# Altium schematic sheet RTM_CON.SchDoc
size A3; DocumentNumber: 21; SheetNumber: 21; SheetTotal: 30
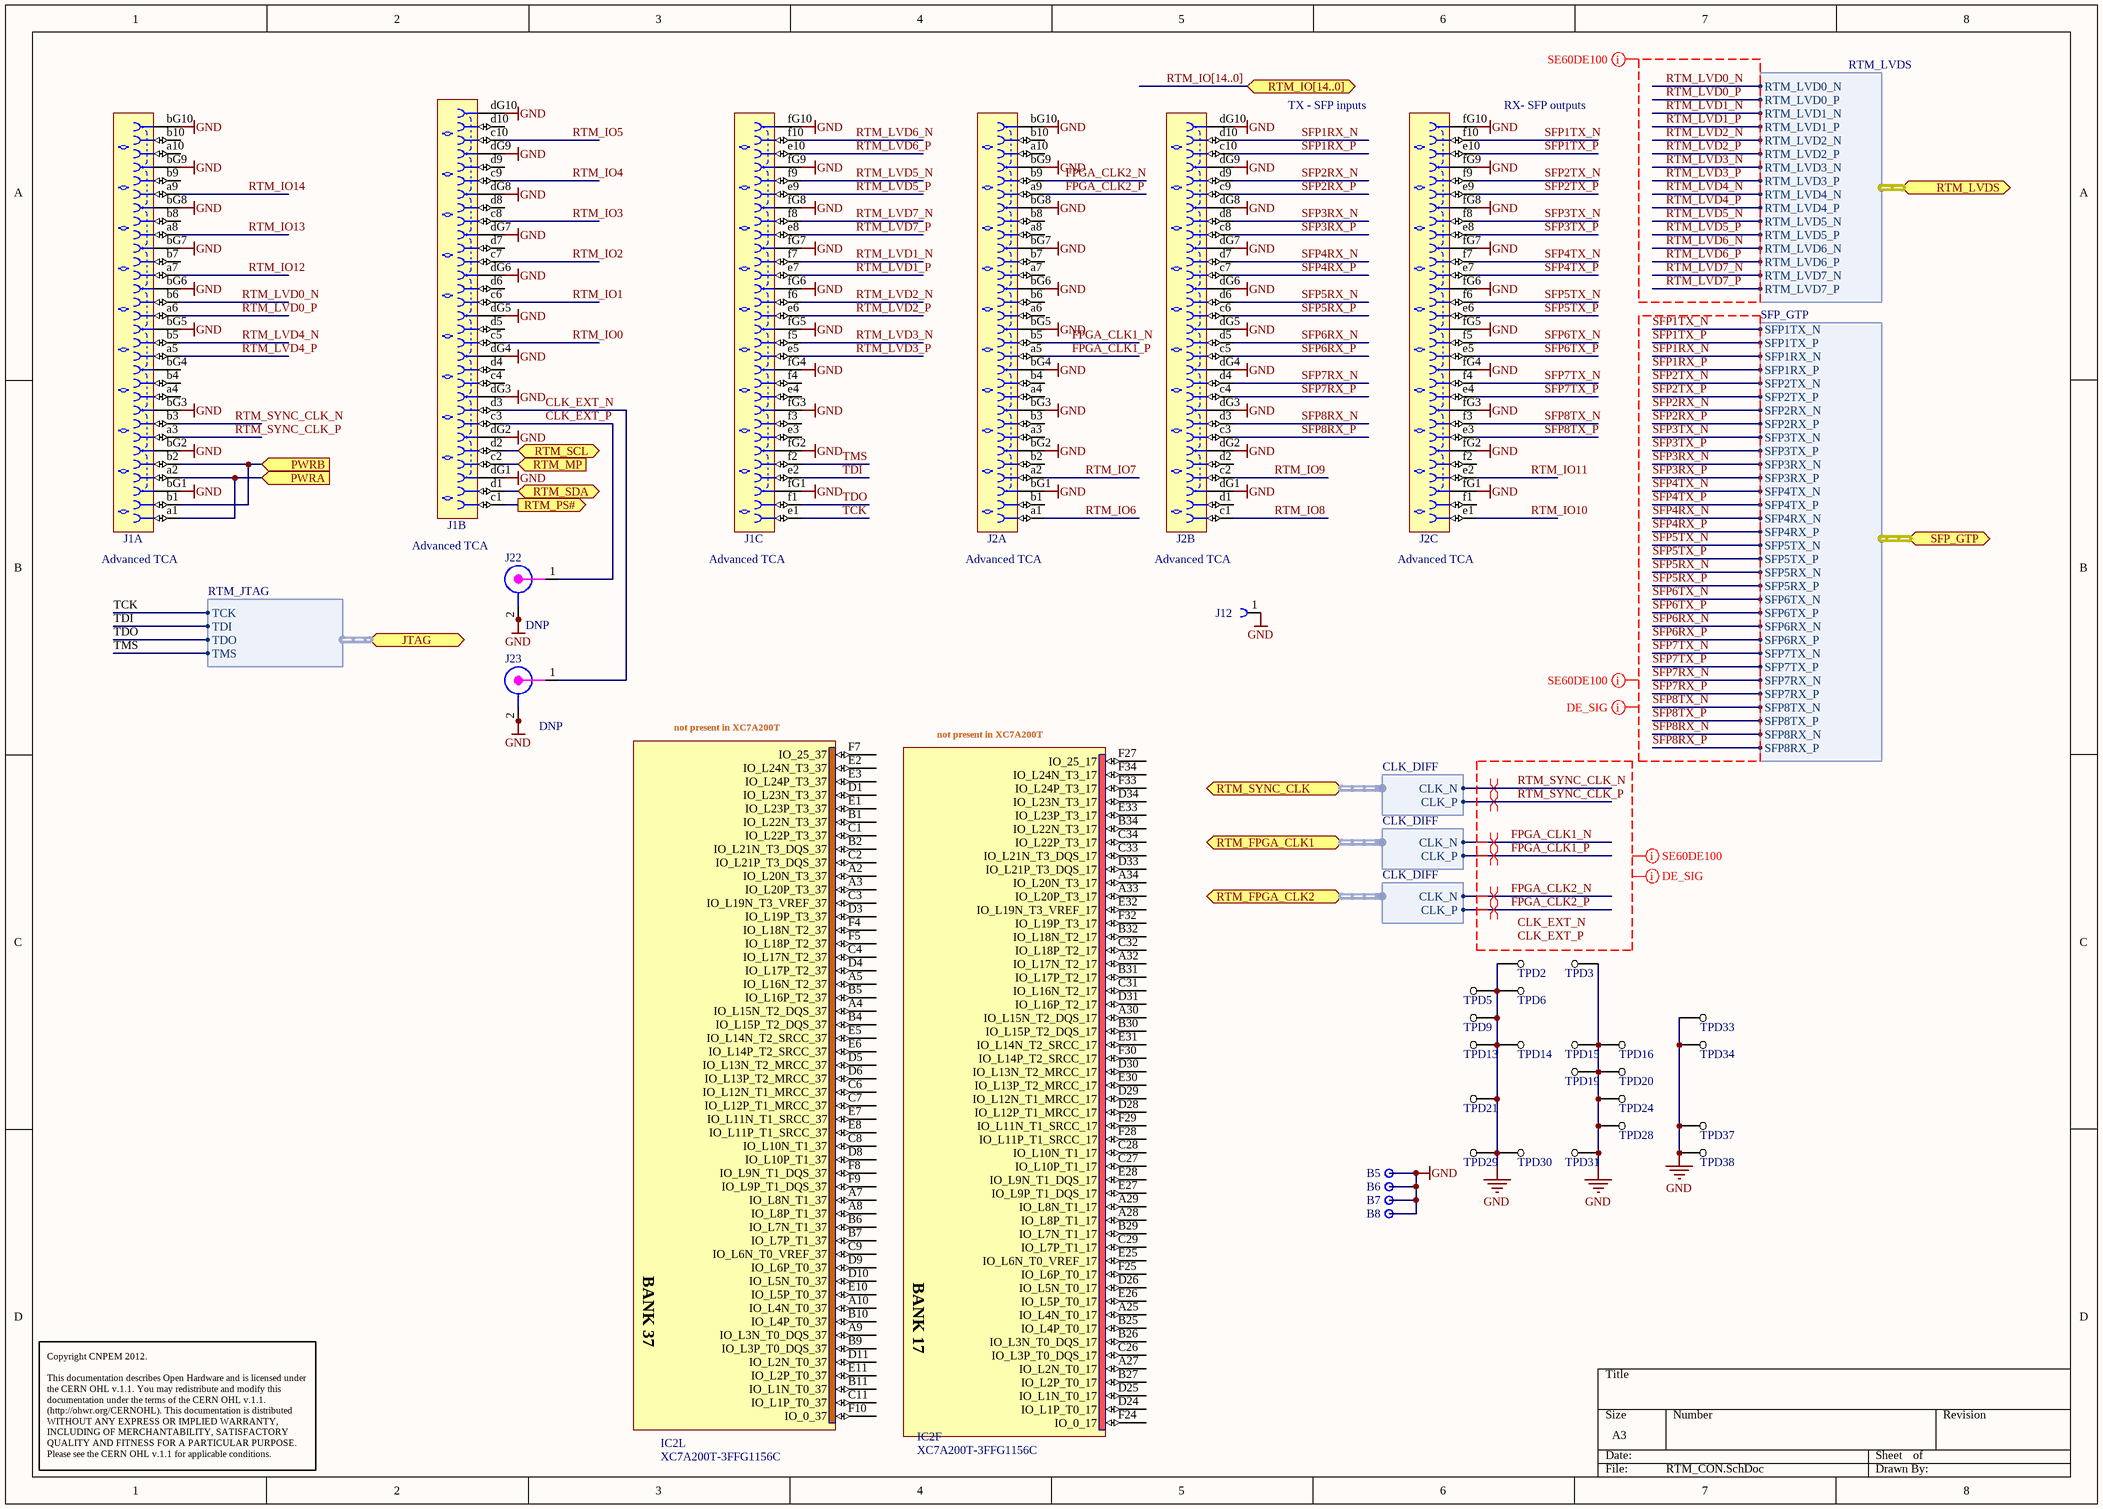
[diagram p0: RTM_CON.SchDoc]

## Parts
B5  Test Point  [VERO_20-2136]  (value not drawn)
B6  Test Point  [VERO_20-2136]  (value not drawn)
B7  Test Point  [VERO_20-2136]  (value not drawn)
B8  Test Point  [VERO_20-2136]  (value not drawn)
IC2  XC7A200T-3FFG1156C  [BGA1156C100P34X34_3500X3500X335]  (parts F,L of 23)
J1  Advanced TCA  [TYCO_6469081-1]  (parts A,B,C of 3)
J2  Advanced TCA  [TYCO_6469081-1]  (parts A,B,C of 3)
J12  (no value)  [TYCO_5120913-1]
J22  DNP  [CON_UFL_HIROSE_RECEPTACLE]
J23  DNP  [CON_UFL_HIROSE_RECEPTACLE]
TPD2  Test Point  [TP_DIFF_0805]  (value not drawn)
TPD3  Test Point  [TP_DIFF_0805]  (value not drawn)
TPD5  Test Point  [TP_DIFF_0805]  (value not drawn)
TPD6  Test Point  [TP_DIFF_0805]  (value not drawn)
TPD9  Test Point  [TP_DIFF_0805]  (value not drawn)
TPD13  Test Point  [TP_DIFF_0805]  (value not drawn)
TPD14  Test Point  [TP_DIFF_0805]  (value not drawn)
TPD15  Test Point  [TP_DIFF_0805]  (value not drawn)
TPD16  Test Point  [TP_DIFF_0805]  (value not drawn)
TPD19  Test Point  [TP_DIFF_0805]  (value not drawn)
TPD20  Test Point  [TP_DIFF_0805]  (value not drawn)
TPD21  Test Point  [TP_DIFF_0805]  (value not drawn)
TPD24  Test Point  [TP_DIFF_0805]  (value not drawn)
TPD28  Test Point  [TP_DIFF_0805]  (value not drawn)
TPD29  Test Point  [TP_DIFF_0805]  (value not drawn)
TPD30  Test Point  [TP_DIFF_0805]  (value not drawn)
TPD31  Test Point  [TP_DIFF_0805]  (value not drawn)
TPD33  Test Point  [TP_DIFF_0805]  (value not drawn)
TPD34  Test Point  [TP_DIFF_0805]  (value not drawn)
TPD37  Test Point  [TP_DIFF_0805]  (value not drawn)
TPD38  Test Point  [TP_DIFF_0805]  (value not drawn)

## Ports
JTAG (harness RTM_JTAG), PWRA (in), PWRB (in), RTM_FPGA_CLK1 (harness CLK_DIFF), RTM_FPGA_CLK2 (harness CLK_DIFF), RTM_IO[14..0] (bidir, harness JTAG), RTM_LVDS (harness RTM_LVDS), RTM_MP (in), RTM_PS# (out), RTM_SCL (bidir), RTM_SDA (bidir), RTM_SYNC_CLK (harness CLK_DIFF), SFP_GTP (harness SFP_GTP)

## Harnesses
RTM_LVDS: RTM_LVD0_N, RTM_LVD0_P, RTM_LVD1_N, RTM_LVD1_P, RTM_LVD2_N, RTM_LVD2_P, RTM_LVD3_N, RTM_LVD3_P, RTM_LVD4_N, RTM_LVD4_P, RTM_LVD5_N, RTM_LVD5_P, RTM_LVD6_N, RTM_LVD6_P, RTM_LVD7_N, RTM_LVD7_P
SFP_GTP: SFP1RX_N, SFP1RX_P, SFP1TX_N, SFP1TX_P, SFP2TX_N, SFP2TX_P, SFP2RX_N, SFP2RX_P, SFP3TX_N, SFP3TX_P, SFP3RX_N, SFP3RX_P, SFP4TX_N, SFP4TX_P, SFP4RX_N, SFP4RX_P, SFP5TX_N, SFP5TX_P, SFP5RX_N, SFP5RX_P, SFP6TX_N, SFP6TX_P, SFP6RX_N, SFP6RX_P, SFP7TX_N, SFP7TX_P, SFP7RX_N, SFP7RX_P, SFP8TX_N, SFP8TX_P, SFP8RX_N, SFP8RX_P
RTM_JTAG: TCK, TDI, TDO, TMS
CLK_DIFF: CLK_P, CLK_N

## Nets
GND: B5.1 B6.1 B7.1 B8.1 J1.bG1 J1.bG2 J1.bG3 J1.bG5 J1.bG6 J1.bG7 J1.bG8 J1.bG9 J1.bG10 J1.dG1 J1.dG2 J1.dG3 J1.dG4 J1.dG5 J1.dG6 J1.dG7 J1.dG8 J1.dG9 J1.dG10 J1.fG1 J1.fG2 J1.fG3 J1.fG4 J1.fG5 J1.fG6 J1.fG7 J1.fG8 J1.fG9 J1.fG10 J2.bG1 J2.bG2 J2.bG3 J2.bG4 J2.bG5 J2.bG6 J2.bG7 J2.bG8 J2.bG9 J2.bG10 J2.dG1 J2.dG2 J2.dG3 J2.dG4 J2.dG5 J2.dG6 J2.dG7 J2.dG8 J2.dG9 J2.dG10 J2.fG1 J2.fG2 J2.fG3 J2.fG4 J2.fG5 J2.fG6 J2.fG7 J2.fG8 J2.fG9 J2.fG10 J12.1 J22.2 J22.2a(GND) J23.2 J23.2a(GND) TPD2.1(TP) TPD3.1(TP) TPD5.1(TP) TPD6.1(TP) TPD9.1(TP) TPD13.1(TP) TPD14.1(TP) TPD15.1(TP) TPD16.1(TP) TPD19.1(TP) TPD20.1(TP) TPD21.1(TP) TPD24.1(TP) TPD28.1(TP) TPD29.1(TP) TPD30.1(TP) TPD31.1(TP) TPD33.1(TP) TPD34.1(TP) TPD37.1(TP) TPD38.1(TP)
CLK_EXT_N: J1.d3 J23.1
CLK_EXT_P: J1.c3 J22.1
FPGA_CLK1_N: J2.b5 ; port RTM_FPGA_CLK1.CLK_N
FPGA_CLK1_P: J2.a5 ; port RTM_FPGA_CLK1.CLK_P
FPGA_CLK2_N: J2.b9 ; port RTM_FPGA_CLK2.CLK_N
FPGA_CLK2_P: J2.a9 ; port RTM_FPGA_CLK2.CLK_P
PWRA: J1.a1 J1.a2 ; port PWRA
PWRB: J1.b1 J1.b2 ; port PWRB
RTM_IO0: J1.c5
RTM_IO1: J1.c6
RTM_IO2: J1.c7
RTM_IO3: J1.c8
RTM_IO4: J1.c9
RTM_IO5: J1.c10
RTM_IO6: J2.a1
RTM_IO7: J2.a2
RTM_IO8: J2.c1
RTM_IO9: J2.c2
RTM_IO10: J2.e1
RTM_IO11: J2.e2
RTM_IO12: J1.a7
RTM_IO13: J1.a8
RTM_IO14: J1.a9
RTM_LVD0_N: J1.b6 ; port RTM_LVDS.RTM_LVD0_N
RTM_LVD0_P: J1.a6 ; port RTM_LVDS.RTM_LVD0_P
RTM_LVD1_N: J1.f7 ; port RTM_LVDS.RTM_LVD1_N
RTM_LVD1_P: J1.e7 ; port RTM_LVDS.RTM_LVD1_P
RTM_LVD2_N: J1.f6 ; port RTM_LVDS.RTM_LVD2_N
RTM_LVD2_P: J1.e6 ; port RTM_LVDS.RTM_LVD2_P
RTM_LVD3_N: J1.f5 ; port RTM_LVDS.RTM_LVD3_N
RTM_LVD3_P: J1.e5 ; port RTM_LVDS.RTM_LVD3_P
RTM_LVD4_N: J1.b5 ; port RTM_LVDS.RTM_LVD4_N
RTM_LVD4_P: J1.a5 ; port RTM_LVDS.RTM_LVD4_P
RTM_LVD5_N: J1.f9 ; port RTM_LVDS.RTM_LVD5_N
RTM_LVD5_P: J1.e9 ; port RTM_LVDS.RTM_LVD5_P
RTM_LVD6_N: J1.f10 ; port RTM_LVDS.RTM_LVD6_N
RTM_LVD6_P: J1.e10 ; port RTM_LVDS.RTM_LVD6_P
RTM_LVD7_N: J1.f8 ; port RTM_LVDS.RTM_LVD7_N
RTM_LVD7_P: J1.e8 ; port RTM_LVDS.RTM_LVD7_P
RTM_MP: J1.c2 ; port RTM_MP
RTM_PS#: J1.c1 ; port RTM_PS#
RTM_SCL: J1.d2 ; port RTM_SCL
RTM_SDA: J1.d1 ; port RTM_SDA
RTM_SYNC_CLK_N: J1.b3 ; port RTM_SYNC_CLK.CLK_N
RTM_SYNC_CLK_P: J1.a3 ; port RTM_SYNC_CLK.CLK_P
SFP1RX_N: J2.d10 ; port SFP_GTP.SFP1RX_N
SFP1RX_P: J2.c10 ; port SFP_GTP.SFP1RX_P
SFP1TX_N: J2.f10 ; port SFP_GTP.SFP1TX_N
SFP1TX_P: J2.e10 ; port SFP_GTP.SFP1TX_P
SFP2RX_N: J2.d9 ; port SFP_GTP.SFP2RX_N
SFP2RX_P: J2.c9 ; port SFP_GTP.SFP2RX_P
SFP2TX_N: J2.f9 ; port SFP_GTP.SFP2TX_N
SFP2TX_P: J2.e9 ; port SFP_GTP.SFP2TX_P
SFP3RX_N: J2.d8 ; port SFP_GTP.SFP3RX_N
SFP3RX_P: J2.c8 ; port SFP_GTP.SFP3RX_P
SFP3TX_N: J2.f8 ; port SFP_GTP.SFP3TX_N
SFP3TX_P: J2.e8 ; port SFP_GTP.SFP3TX_P
SFP4RX_N: J2.d7 ; port SFP_GTP.SFP4RX_N
SFP4RX_P: J2.c7 ; port SFP_GTP.SFP4RX_P
SFP4TX_N: J2.f7 ; port SFP_GTP.SFP4TX_N
SFP4TX_P: J2.e7 ; port SFP_GTP.SFP4TX_P
SFP5RX_N: J2.d6 ; port SFP_GTP.SFP5RX_N
SFP5RX_P: J2.c6 ; port SFP_GTP.SFP5RX_P
SFP5TX_N: J2.f6 ; port SFP_GTP.SFP5TX_N
SFP5TX_P: J2.e6 ; port SFP_GTP.SFP5TX_P
SFP6RX_N: J2.d5 ; port SFP_GTP.SFP6RX_N
SFP6RX_P: J2.c5 ; port SFP_GTP.SFP6RX_P
SFP6TX_N: J2.f5 ; port SFP_GTP.SFP6TX_N
SFP6TX_P: J2.e5 ; port SFP_GTP.SFP6TX_P
SFP7RX_N: J2.d4 ; port SFP_GTP.SFP7RX_N
SFP7RX_P: J2.c4 ; port SFP_GTP.SFP7RX_P
SFP7TX_N: J2.f4 ; port SFP_GTP.SFP7TX_N
SFP7TX_P: J2.e4 ; port SFP_GTP.SFP7TX_P
SFP8RX_N: J2.d3 ; port SFP_GTP.SFP8RX_N
SFP8RX_P: J2.c3 ; port SFP_GTP.SFP8RX_P
SFP8TX_N: J2.f3 ; port SFP_GTP.SFP8TX_N
SFP8TX_P: J2.e3 ; port SFP_GTP.SFP8TX_P
TCK: J1.e1 ; port JTAG.TCK
TDI: J1.e2 ; port JTAG.TDI
TDO: J1.f1 ; port JTAG.TDO
TMS: J1.f2 ; port JTAG.TMS

Not connected (* = marked no-connect by the designer): IC2 A2(IO_L20N_T3_37) A3(IO_L20P_T3_37) A4(IO_L15N_T2_DQS_37) A5(IO_L16N_T2_37) A7(IO_L8N_T1_37) A8(IO_L8P_T1_37) A9(IO_L3N_T0_DQS_37) A10(IO_L4N_T0_37) A25(IO_L4N_T0_17) A27(IO_L2N_T0_17) A28(IO_L8P_T1_17) A29(IO_L8N_T1_17) A30(IO_L15N_T2_DQS_17) A32(IO_L17N_T2_17) A33(IO_L20P_T3_17) A34(IO_L20N_T3_17) B1(IO_L22N_T3_37) B2(IO_L21N_T3_DQS_37) B4(IO_L15P_T2_DQS_37) B5(IO_L16P_T2_37) B6(IO_L7N_T1_37) B7(IO_L7P_T1_37) B9(IO_L3P_T0_DQS_37) B10(IO_L4P_T0_37) B11(IO_L1N_T0_37) B25(IO_L4P_T0_17) B26(IO_L3N_T0_DQS_17) B27(IO_L2P_T0_17) B29(IO_L7N_T1_17) B30(IO_L15P_T2_DQS_17) B31(IO_L17P_T2_17) B32(IO_L18N_T2_17) B34(IO_L22N_T3_17) C1(IO_L22P_T3_37) C2(IO_L21P_T3_DQS_37) C3(IO_L19N_T3_VREF_37) C4(IO_L17N_T2_37) C6(IO_L12N_T1_MRCC_37) C7(IO_L12P_T1_MRCC_37) C8(IO_L10N_T1_37) C9(IO_L6N_T0_VREF_37) C11(IO_L1P_T0_37) C26(IO_L3P_T0_DQS_17) C27(IO_L10P_T1_17) C28(IO_L10N_T1_17) C29(IO_L7P_T1_17) C31(IO_L16N_T2_17) C32(IO_L18P_T2_17) C33(IO_L21N_T3_DQS_17) C34(IO_L22P_T3_17) D1(IO_L23N_T3_37) D3(IO_L19P_T3_37) D4(IO_L17P_T2_37) D5(IO_L13N_T2_MRCC_37) D6(IO_L13P_T2_MRCC_37) D8(IO_L10P_T1_37) D9(IO_L6P_T0_37) D10(IO_L5N_T0_37) D11(IO_L2N_T0_37) D24(IO_L1P_T0_17) D25(IO_L1N_T0_17) D26(IO_L5N_T0_17) D28(IO_L12P_T1_MRCC_17) D29(IO_L12N_T1_MRCC_17) D30(IO_L13N_T2_MRCC_17) D31(IO_L16P_T2_17) D33(IO_L21P_T3_DQS_17) D34(IO_L23N_T3_17) E1(IO_L23P_T3_37) E2(IO_L24N_T3_37) E3(IO_L24P_T3_37) E5(IO_L14N_T2_SRCC_37) E6(IO_L14P_T2_SRCC_37) E7(IO_L11N_T1_SRCC_37) E8(IO_L11P_T1_SRCC_37) E10(IO_L5P_T0_37) E11(IO_L2P_T0_37) E25(IO_L6N_T0_VREF_17) E26(IO_L5P_T0_17) E27(IO_L9P_T1_DQS_17) E28(IO_L9N_T1_DQS_17) E30(IO_L13P_T2_MRCC_17) E31(IO_L14N_T2_SRCC_17) E32(IO_L19N_T3_VREF_17) E33(IO_L23P_T3_17) F4(IO_L18N_T2_37) F5(IO_L18P_T2_37) F7(IO_25_37) F8(IO_L9N_T1_DQS_37) F9(IO_L9P_T1_DQS_37) F10(IO_0_37) F24(IO_0_17) F25(IO_L6P_T0_17) F27(IO_25_17) F28(IO_L11P_T1_SRCC_17) F29(IO_L11N_T1_SRCC_17) F30(IO_L14P_T2_SRCC_17) F32(IO_L19P_T3_17) F33(IO_L24P_T3_17) F34(IO_L24N_T3_17); J1 a4 a10 b4 b7 b8 b9 b10 bG4 c4 d4 d5 d6 d7 d8 d9 d10 e3 e4 f3 f4; J2 a3 a4 a6 a7 a8 a10 b1 b2 b3 b4 b6 b7 b8 b10 d1 d2 f1 f2

## Buses and harness runs
bus RTM_IO[14..0]

## Layout directives
net class SE60DE100: CLK_EXT_N, CLK_EXT_P, FPGA_CLK1_N, FPGA_CLK1_P, FPGA_CLK2_N, FPGA_CLK2_P, RTM_LVD0_N, RTM_LVD0_P, RTM_LVD1_N, RTM_LVD1_P, RTM_LVD2_N, RTM_LVD2_P, RTM_LVD3_N, RTM_LVD3_P, RTM_LVD4_N, RTM_LVD4_P, RTM_LVD5_N, RTM_LVD5_P, RTM_LVD6_N, RTM_LVD6_P, RTM_LVD7_N, RTM_LVD7_P, RTM_SYNC_CLK_N, RTM_SYNC_CLK_P, SFP1RX_N, SFP1RX_P, SFP1TX_N, SFP1TX_P, SFP2RX_N, SFP2RX_P, SFP2TX_N, SFP2TX_P, SFP3RX_N, SFP3RX_P, SFP3TX_N, SFP3TX_P, SFP4RX_N, SFP4RX_P, SFP4TX_N, SFP4TX_P, SFP5RX_N, SFP5RX_P, SFP5TX_N, SFP5TX_P, SFP6RX_N, SFP6RX_P, SFP6TX_N, SFP6TX_P, SFP7RX_N, SFP7RX_P, SFP7TX_N, SFP7TX_P, SFP8RX_N, SFP8RX_P, SFP8TX_N, SFP8TX_P
net class DE_SIG: CLK_EXT_N, CLK_EXT_P, FPGA_CLK1_N, FPGA_CLK1_P, FPGA_CLK2_N, FPGA_CLK2_P, RTM_SYNC_CLK_N, RTM_SYNC_CLK_P, SFP1RX_N, SFP1RX_P, SFP1TX_N, SFP1TX_P, SFP2RX_N, SFP2RX_P, SFP2TX_N, SFP2TX_P, SFP3RX_N, SFP3RX_P, SFP3TX_N, SFP3TX_P, SFP4RX_N, SFP4RX_P, SFP4TX_N, SFP4TX_P, SFP5RX_N, SFP5RX_P, SFP5TX_N, SFP5TX_P, SFP6RX_N, SFP6RX_P, SFP6TX_N, SFP6TX_P, SFP7RX_N, SFP7RX_P, SFP7TX_N, SFP7TX_P, SFP8RX_N, SFP8RX_P, SFP8TX_N, SFP8TX_P
differential pair: FPGA_CLK1_N, FPGA_CLK1_P, FPGA_CLK2_N, FPGA_CLK2_P, RTM_SYNC_CLK_N, RTM_SYNC_CLK_P

## Notes on the sheet
- TX - SFP inputs
- RX- SFP outputs
- not present in XC7A200T
- Copyright CNPEM 2012.
  This documentation describes Open Hardware and is licensed under the CERN OHL v.1.1. You may redistribute and modify this documentation under the terms of the CERN OHL v.1.1. (http://ohwr.org/CERNOHL). This documentation is distributed WITHOUT ANY EXPRESS OR IMPLIED WARRANTY, INCLUDING OF MERCHANTABILITY, SATISFACTORY QUALITY AND FITNESS FOR A PARTICULAR PURPOSE. Please see the CERN OHL v.1.1 for applicable conditions.
- Labels drawn without touching a wire or pin: CLK_EXT_N, CLK_EXT_P
- (in symbol XC7A200T-3FFG1156C, part F) BANK 17
- (in symbol XC7A200T-3FFG1156C, part L) BANK 37

## Library data of the parts
B5-B8 = VERO_20-2136: Single Terminal Socket; Part Description: Black Bead PCB Terminal Test Pin (1.32 mm hole); Manufacturer: VERO TECHNOLOGIES; Table: Miscellaneous; Part Number: VERO_20-2136; Component Kind: Standard; Component Type: Standard; Pin Count: 1; Family: Test Point; Mounted: Yes; Socket: No; SMD: No; Status: None; Manufacturer Part Number: 20-2136; ComponentHeight: 5.3mm; HelpURL: \\cern.ch\dfs\Applications\Altium\Datasheets\VERO_20-2136.pdf; Author: CERN DEM JLC; CreateDate: 21/07/2008; LatestRevisionDate: 21/07/2008
IC2 = XC7A200T-3FFG1156C: Artix-6 FPGA, 16 GTPs, 600 User I/Os, 1156-Pin BGA, Speed Grade 2, Commercial Grade, Pb-Free; Part Description: Artix-7 FPGA, 16 GTPs, 600 User I/Os, 1156-Pin BGA, Speed Grade 2, Commercial Grade, Pb-Free; Manufacturer: XILINX; Table: Logic; Part Number: XC7A200T-3FFG1156C; Component Kind: Standard; Component Type: Standard; Device: XC7A200T-3FFG1156C; PackageDescription: BGA, 1.00mm Pitch, Square; 1156 Pin, 34 Columns X 34 Rows, 35.00mm X 35.00mm X 3.350mm H; Manufacturer Part Number: XC7A200T-3FFG1156C; Pin Count: 1156; Case: BGA1156; Mounted: Yes; Socket: No; SMD: Yes; ComponentHeight: 3.35mm; HelpURL: \\cern.ch\dfs\Applications\Altium\Datasheets\XC7A350T-2FFG1156C.pdf; ComponentLink1URL: \\cern.ch\dfs\Applications\Altium\Datasheets\XC7A350T-2FFG1156C.pdf; ComponentLink1Description: Package/Pinout; Author: CERN DEM JLC; CreateDate: 2012-09-19; LatestRevisionDate: 2012-09-19
J1 J2 = TYCO_6469081-1: Connector 60 ATCA Female 30 Pairs (60 Signals) + 3x10 Ground; Part Description: 60 Positions, Pitch 2.5mm,  Advanced TCA, Z-PACK HM-Zd Right Angle Press Fit Receptacle; Manufacturer: TYCO ELECTRONICS; Table: TYCO; Part Number: TYCO_6469081-1; Component Kind: Standard; Component Type: Standard; Pin Count: 90; Family: Advanced TCA; Mounted: Yes; Socket: No; SMD: No; Status: None; Manufacturer Part Number: 6469081-1; ComponentHeight: 12.18mm; HelpURL: \\cern.ch\dfs\Applications\Altium\Datasheets\TYCO_6469081-1.pdf; Author: CERN DEM JLC; CreateDate: 2013-08-28; LatestRevisionDate: 2013-08-28
J12 = TYCO_5120913-1: Single Pin Female; Part Number: TYCO_5120913-1
J22 J23 = CON_UFL_SMD: UFL; Supplier 1: Newark; Supplier Part Number 1: 50P8856
TPD2 TPD3 TPD5 TPD6 TPD9 TPD13-TPD16 TPD19-TPD21 TPD24 TPD28-TPD31 TPD33 TPD34 TPD37 TPD38 = TP_DIFF: 1625854-2; Bottom_EstimationX (mm): 0; Document Name: RTM_CON.SchDoc; Part Number: TP_DIFF; ParamsList: Test Point; FootprintSizeX (mm): 4; FootprintSizeY (mm): 2; FootprintRectangleArea (mm): 8; Thickness (Max) (mm): 2; Bottom_EstimationY (mm): 0; Bottom_Area_Estimation (mm): 0; FootprintAlias: TP_SMD_0805